# EAGLE schematic RF AMP 1W (EAGLE 6.4)
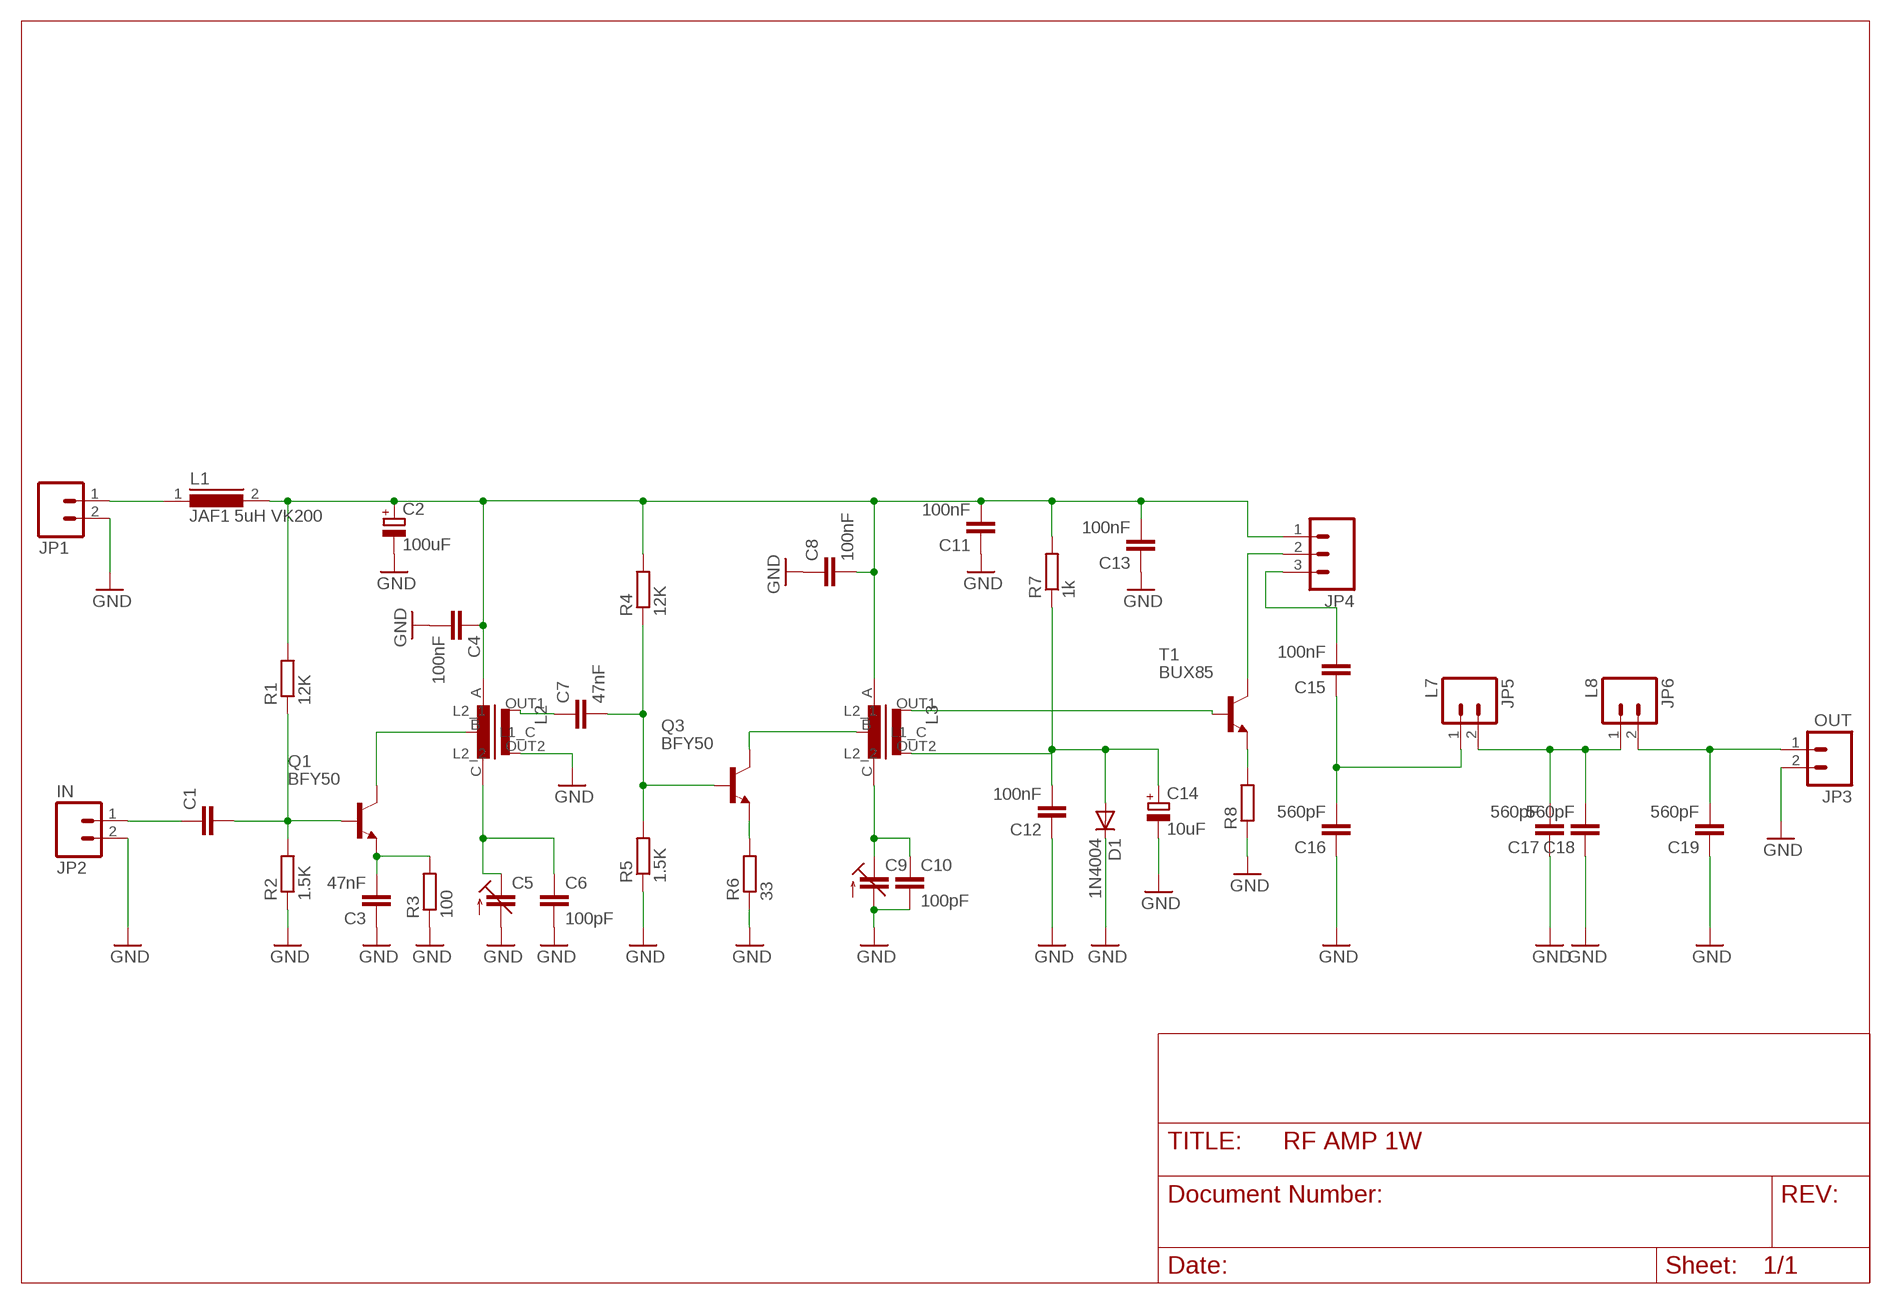
[diagram p0: schematic, sheet 1]

## Parts
C1  C-EU025-025X050  [C025-025X050]
C2  100uF  CPOL-EUE2-5  [E2-5]
C3  47nF  C-EU025-025X050  [C025-025X050]
C4  100nF  C-EU025-025X050  [C025-025X050]
C5  C-TRIMM808  [CTRIM808-BC]
C6  100pF  C-EU025-025X050  [C025-025X050]
C7  47nF  C-EU025-025X050  [C025-025X050]
C8  100nF  C-EU025-025X050  [C025-025X050]
C9  C-TRIMM808  [CTRIM808-BC]
C10  100pF  C-EU025-025X050  [C025-025X050]
C11  100nF  C-EU025-025X050  [C025-025X050]
C12  100nF  C-EU025-025X050  [C025-025X050]
C13  100nF  C-EU025-025X050  [C025-025X050]
C14  10uF  CPOL-EUE2-5  [E2-5]
C15  100nF  C-EU025-025X050  [C025-025X050]
C16  560pF  C-EU025-025X050  [C025-025X050]
C17  560pF  C-EU025-025X050  [C025-025X050]
C18  560pF  C-EU025-025X050  [C025-025X050]
C19  560pF  C-EU025-025X050  [C025-025X050]
D1  1N4004  [DO41-10]
JP1  M023.5MM  [SCREWTERMINAL-3.5MM-2]
JP2  IN  M023.5MM  [SCREWTERMINAL-3.5MM-2]
JP3  OUT  M023.5MM  [SCREWTERMINAL-3.5MM-2]
JP4  M03-SCREW-5MM  [SCREWTERMINAL-5MM-3]
JP5  L7  M025MM  [SCREWTERMINAL-5MM-2]
JP6  L8  M025MM  [SCREWTERMINAL-5MM-2]
L1  JAF1 5uH VK200  82114A  [82114A]
L2  ED16  [ED16]
L3  ED16  [ED16]
Q1  BFY50  [TO39]
Q3  BFY50  [TO39]
R1  12K  R-EU_0207/10  [0207/10]
R2  1.5K  R-EU_0207/10  [0207/10]
R3  100  R-EU_0207/10  [0207/10]
R4  12K  R-EU_0207/10  [0207/10]
R5  1.5K  R-EU_0207/10  [0207/10]
R6  33  R-EU_0207/10  [0207/10]
R7  1k  R-EU_0207/10  [0207/10]
R8  R-EU_0207/12  [0207/12]
T1  BUX85  [TO220]

## Nets
GND: C2.- C3.1 C4.2 C5.2(A) C6.2 C8.1 C9.2(A) C10.2 C11.1 C12.1 C13.1 C14.- C16.1 C17.1 C18.1 C19.1 D1.C JP1.2 JP2.2 JP3.2 L2.OUT2(L2_2) R2.1 R3.1 R5.1 R6.1 R8.1
N$1: JP1.1 L1.1
N$2: C2.+ C4.1 C8.2 C11.2 C13.2 JP4.1 L1.2 L2.A(L1_1) L3.A(L1_1) R1.2 R4.2 R7.2
N$3: C1.2 Q1.2(B) R1.1 R2.2
N$4: C1.1 JP2.1
N$5: C3.2 Q1.1(E) R3.2
N$6: L2.B(L1_C) Q1.3(C)
N$7: C5.1(E) C6.1 L2.C(L1_2)
N$8: R8.2 T1.3(E)
N$9: JP4.2 T1.2(C)
N$11: C7.2 Q3.2(B) R4.1 R5.2
N$12: C15.2 JP4.3
N$13: C15.1 C16.2 JP5.1
N$14: Q3.1(E) R6.2
N$15: L3.B(L1_C) Q3.3(C)
N$16: C9.1(E) C10.1 L3.C(L1_2)
N$17: L3.OUT1(L2_1) T1.1(B)
N$18: C12.2 C14.+ D1.A L3.OUT2(L2_2) R7.1
N$19: C7.1 L2.OUT1(L2_1)
N$20: C17.2 C18.2 JP5.2 JP6.1
N$21: C19.2 JP3.1 JP6.2

## Library data of the parts
C1 C3 C4 C6-C8 C10-C13 C15-C19 = rcl:C-EU: CAPACITOR, European symbol
C2 C14 = rcl:CPOL-EU: POLARIZED CAPACITOR, European symbol
C5 C9 = rcl:C-TRIMM: Trimm capacitor
D1 = diode:1N4004: DIODE general purpose rectifier, 1 A
JP1-JP3 JP5 JP6 = SparkFun-Connectors:M02: Header 2 Standard 2-pin 0.1" header. Use with straight break away headers (SKU : PRT-00116), right angle break away headers (PRT-00553), swiss pins (PRT-00743), machine pins (PRT-00117), and female headers (PRT-00115). Molex polarized connector foot print use with SKU : PRT-08233 with associated crimp pins and housings.
JP4 = SparkFun-Connectors:M03: Header 3 Standard 3-pin 0.1" header. Use with straight break away headers (SKU : PRT-00116), right angle break away headers (PRT-00553), swiss pins (PRT-00743), machine pins (PRT-00117), and female headers (PRT-00115). Molex polarized connector foot print use with SKU : PRT-08232 with associated crimp pins and housings.
L1 = inductors:82114A: INDUCTOR
L2 L3 = inductors:ED16: INDUCTOR
Q1 Q3 = transistor-npn:BFY50*: NPN Transistor
R1-R8 = rcl:R-EU_: RESISTOR, European symbol
T1 = transistor:BUX85: NPN TRANSISTOR